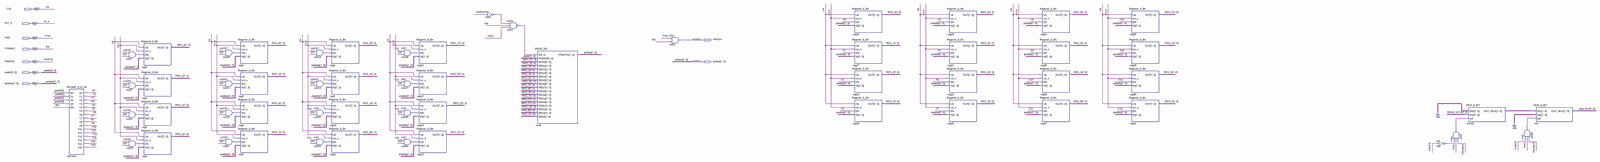
[diagram p0: schematic sheet, whole]
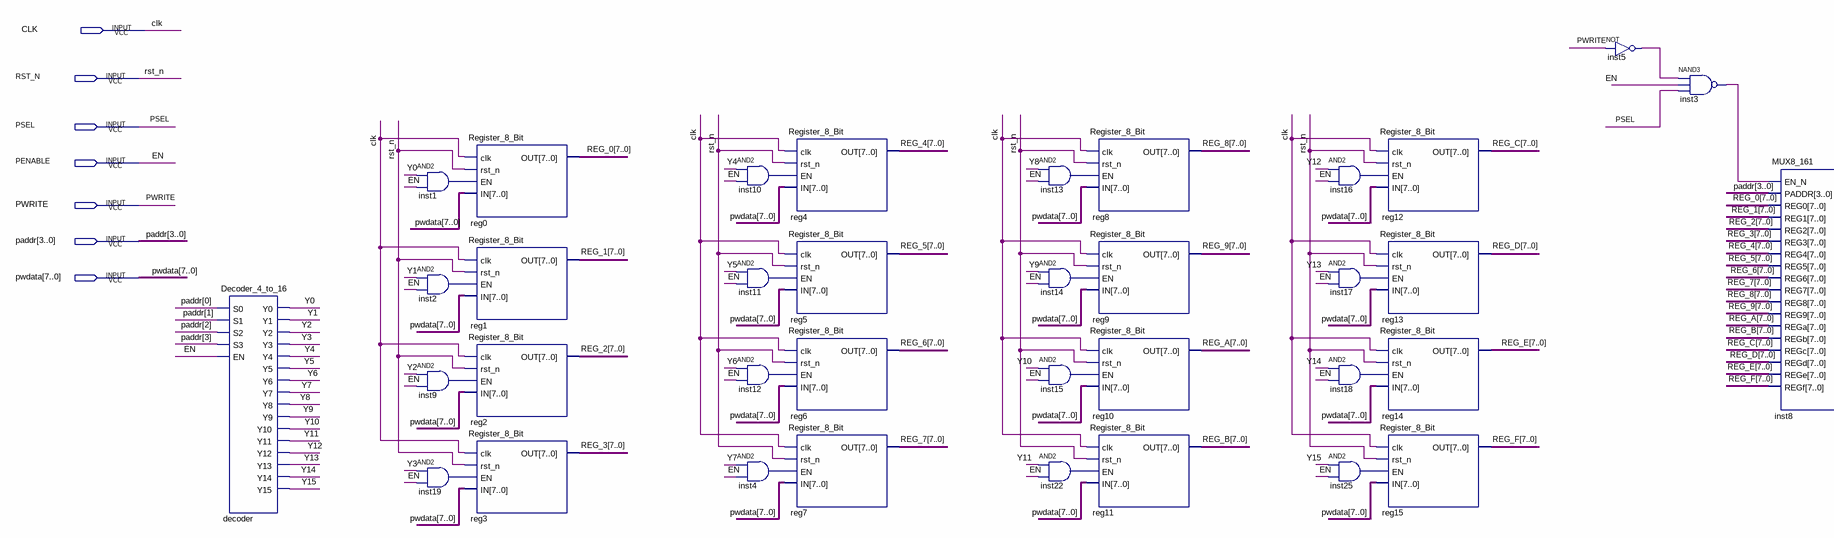
[diagram p1: schematic sheet, left part]
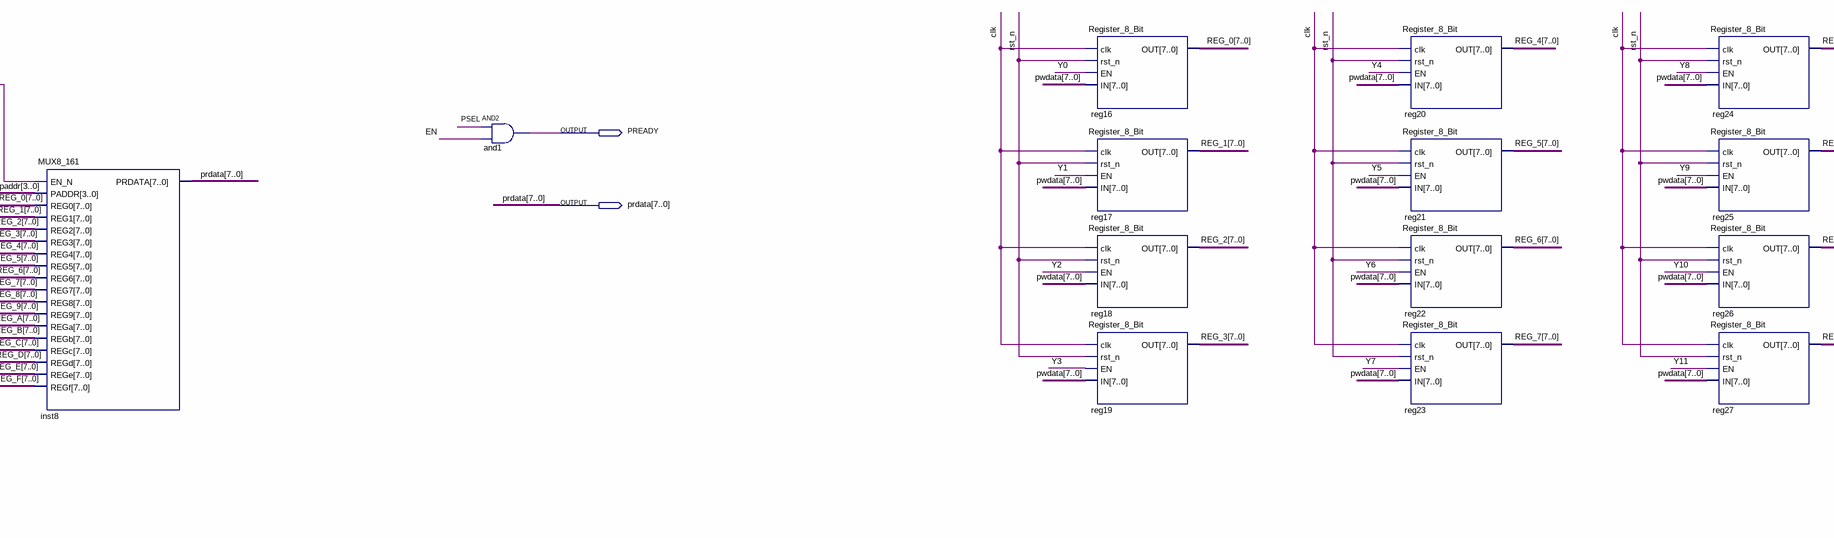
[diagram p2: schematic sheet, centre part]
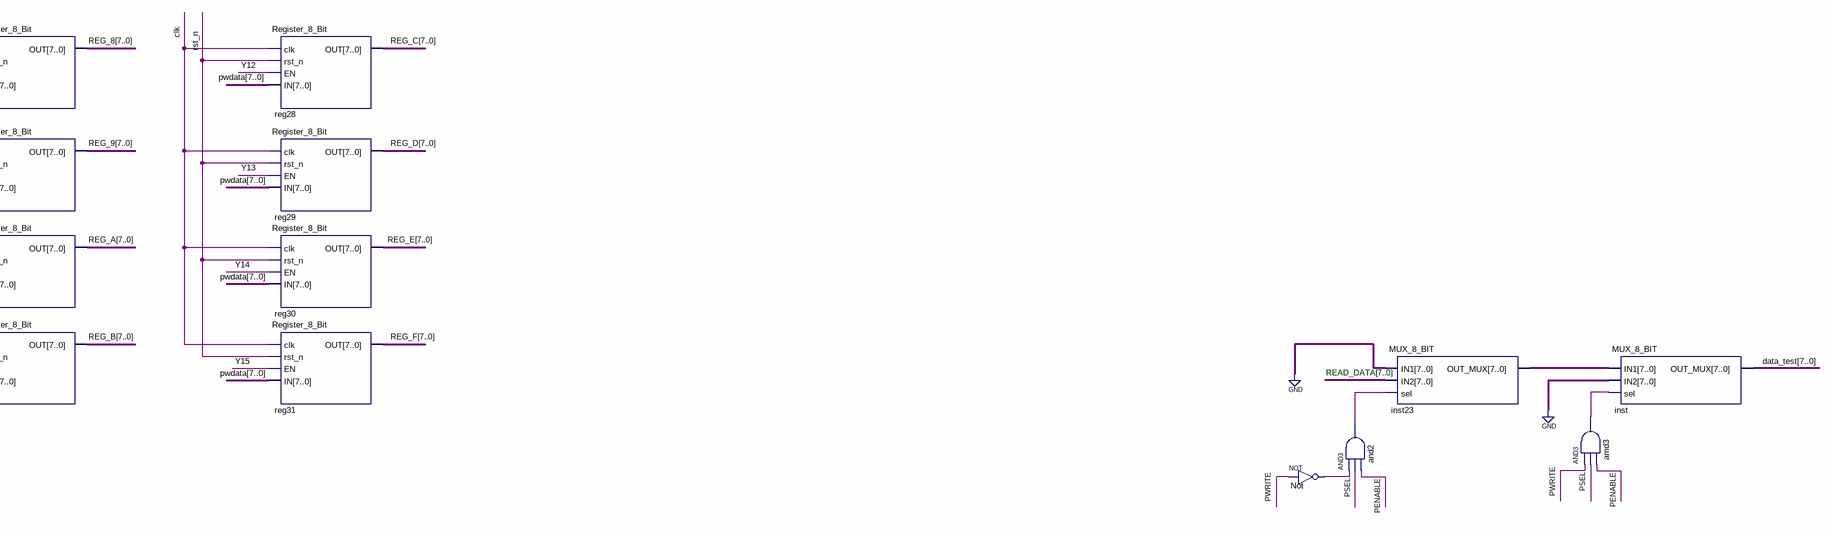
[diagram p3: schematic sheet, right part]
// Quartus schematic temp.bdf as structural Verilog: 58 symbols, 9 pins
module temp (
  input  CLK,
  input  RST_N,
  input  PSEL,
  input  PENABLE,
  input  PWRITE,
  input  [3:0] paddr,
  input  [7:0] pwdata,
  output PREADY,
  output [7:0] prdata
);

  wire amd3_out, and2_out, inst1_out, inst2_out, inst3_out, inst4_out, inst5_out, inst9_out, inst10_out,
       inst11_out, inst12_out, inst13_out, inst14_out, inst15_out, inst16_out, inst17_out, inst18_out,
       inst19_out, inst22_out, inst25_out, Not_out, Y0, Y1, Y2, Y3, Y4, Y5, Y6, Y7, Y8, Y9, Y10, Y11, Y12,
       Y13, Y14, Y15;
  wire [7:0] data_test, inst23_out_mux, READ_DATA, REG_0, REG_1, REG_2, REG_3, REG_4, REG_5, REG_6, REG_7,
       REG_8, REG_9, REG_A, REG_B, REG_C, REG_D, REG_E, REG_F;

  Decoder_4_to_16 decoder (
    .S0(paddr[0]), .S1(paddr[1]), .S2(paddr[2]), .S3(paddr[3]), .EN(PENABLE), .Y0(Y0), .Y1(Y1), .Y2(Y2),
    .Y3(Y3), .Y4(Y4), .Y5(Y5), .Y6(Y6), .Y7(Y7), .Y8(Y8), .Y9(Y9), .Y10(Y10), .Y11(Y11), .Y12(Y12),
    .Y13(Y13), .Y14(Y14), .Y15(Y15));
  and inst1 (inst1_out, Y0, PENABLE);
  and inst2 (inst2_out, Y1, PENABLE);
  and inst9 (inst9_out, Y2, PENABLE);
  and inst19 (inst19_out, Y3, PENABLE);
  Register_8_Bit reg0 (.clk(CLK), .rst_n(RST_N), .EN(inst1_out), .IN(pwdata), .OUT(REG_0));
  Register_8_Bit reg1 (.clk(CLK), .rst_n(RST_N), .EN(inst2_out), .IN(pwdata), .OUT(REG_1));
  Register_8_Bit reg2 (.clk(CLK), .rst_n(RST_N), .EN(inst9_out), .IN(pwdata), .OUT(REG_2));
  Register_8_Bit reg3 (.clk(CLK), .rst_n(RST_N), .EN(inst19_out), .IN(pwdata), .OUT(REG_3));
  and inst10 (inst10_out, Y4, PENABLE);
  and inst11 (inst11_out, Y5, PENABLE);
  and inst12 (inst12_out, Y6, PENABLE);
  and inst4 (inst4_out, Y7, PENABLE);
  Register_8_Bit reg4 (.clk(CLK), .rst_n(RST_N), .EN(inst10_out), .IN(pwdata), .OUT(REG_4));
  Register_8_Bit reg5 (.clk(CLK), .rst_n(RST_N), .EN(inst11_out), .IN(pwdata), .OUT(REG_5));
  Register_8_Bit reg6 (.clk(CLK), .rst_n(RST_N), .EN(inst12_out), .IN(pwdata), .OUT(REG_6));
  Register_8_Bit reg7 (.clk(CLK), .rst_n(RST_N), .EN(inst4_out), .IN(pwdata), .OUT(REG_7));
  and inst13 (inst13_out, Y8, PENABLE);
  and inst14 (inst14_out, Y9, PENABLE);
  and inst15 (inst15_out, Y10, PENABLE);
  and inst22 (inst22_out, Y11, PENABLE);
  Register_8_Bit reg8 (.clk(CLK), .rst_n(RST_N), .EN(inst13_out), .IN(pwdata), .OUT(REG_8));
  Register_8_Bit reg9 (.clk(CLK), .rst_n(RST_N), .EN(inst14_out), .IN(pwdata), .OUT(REG_9));
  Register_8_Bit reg10 (.clk(CLK), .rst_n(RST_N), .EN(inst15_out), .IN(pwdata), .OUT(REG_A));
  Register_8_Bit reg11 (.clk(CLK), .rst_n(RST_N), .EN(inst22_out), .IN(pwdata), .OUT(REG_B));
  and inst16 (inst16_out, Y12, PENABLE);
  and inst17 (inst17_out, Y13, PENABLE);
  and inst18 (inst18_out, Y14, PENABLE);
  and inst25 (inst25_out, Y15, PENABLE);
  Register_8_Bit reg12 (.clk(CLK), .rst_n(RST_N), .EN(inst16_out), .IN(pwdata), .OUT(REG_C));
  Register_8_Bit reg13 (.clk(CLK), .rst_n(RST_N), .EN(inst17_out), .IN(pwdata), .OUT(REG_D));
  Register_8_Bit reg14 (.clk(CLK), .rst_n(RST_N), .EN(inst18_out), .IN(pwdata), .OUT(REG_E));
  Register_8_Bit reg15 (.clk(CLK), .rst_n(RST_N), .EN(inst25_out), .IN(pwdata), .OUT(REG_F));
  not inst5 (inst5_out, PWRITE);
  nand inst3 (inst3_out, inst5_out, PENABLE, PSEL);
  MUX8_161 inst8 (
    .EN_N(inst3_out), .PADDR(paddr), .REG0(REG_0), .REG1(REG_1), .REG2(REG_2), .REG3(REG_3), .REG4(REG_4),
    .REG5(REG_5), .REG6(REG_6), .REG7(REG_7), .REG8(REG_8), .REG9(REG_9), .REGa(REG_A), .REGb(REG_B),
    .REGc(REG_C), .REGd(REG_D), .REGe(REG_E), .REGf(REG_F), .PRDATA(prdata));
  and and1 (PREADY, PSEL, PENABLE);
  Register_8_Bit reg16 (.clk(CLK), .rst_n(RST_N), .EN(Y0), .IN(pwdata), .OUT(REG_0));
  Register_8_Bit reg17 (.clk(CLK), .rst_n(RST_N), .EN(Y1), .IN(pwdata), .OUT(REG_1));
  Register_8_Bit reg18 (.clk(CLK), .rst_n(RST_N), .EN(Y2), .IN(pwdata), .OUT(REG_2));
  Register_8_Bit reg19 (.clk(CLK), .rst_n(RST_N), .EN(Y3), .IN(pwdata), .OUT(REG_3));
  Register_8_Bit reg20 (.clk(CLK), .rst_n(RST_N), .EN(Y4), .IN(pwdata), .OUT(REG_4));
  Register_8_Bit reg21 (.clk(CLK), .rst_n(RST_N), .EN(Y5), .IN(pwdata), .OUT(REG_5));
  Register_8_Bit reg22 (.clk(CLK), .rst_n(RST_N), .EN(Y6), .IN(pwdata), .OUT(REG_6));
  Register_8_Bit reg23 (.clk(CLK), .rst_n(RST_N), .EN(Y7), .IN(pwdata), .OUT(REG_7));
  Register_8_Bit reg24 (.clk(CLK), .rst_n(RST_N), .EN(Y8), .IN(pwdata), .OUT(REG_8));
  Register_8_Bit reg25 (.clk(CLK), .rst_n(RST_N), .EN(Y9), .IN(pwdata), .OUT(REG_9));
  Register_8_Bit reg26 (.clk(CLK), .rst_n(RST_N), .EN(Y10), .IN(pwdata), .OUT(REG_A));
  Register_8_Bit reg27 (.clk(CLK), .rst_n(RST_N), .EN(Y11), .IN(pwdata), .OUT(REG_B));
  Register_8_Bit reg28 (.clk(CLK), .rst_n(RST_N), .EN(Y12), .IN(pwdata), .OUT(REG_C));
  Register_8_Bit reg29 (.clk(CLK), .rst_n(RST_N), .EN(Y13), .IN(pwdata), .OUT(REG_D));
  Register_8_Bit reg30 (.clk(CLK), .rst_n(RST_N), .EN(Y14), .IN(pwdata), .OUT(REG_E));
  Register_8_Bit reg31 (.clk(CLK), .rst_n(RST_N), .EN(Y15), .IN(pwdata), .OUT(REG_F));
  not Not (Not_out, PWRITE);
  and and2 (and2_out, Not_out, PSEL, PENABLE);
  MUX_8_BIT inst23 (.IN1({8{1'b0}}), .IN2(READ_DATA), .sel(and2_out), .OUT_MUX(inst23_out_mux));
  and amd3 (amd3_out, PWRITE, PSEL, PENABLE);
  MUX_8_BIT inst (.IN1(inst23_out_mux), .IN2({8{1'b0}}), .sel(amd3_out), .OUT_MUX(data_test));

  // Other names for the same wires on the sheet: EN = PENABLE

  // Notes on the sheet:
  //   READ_DATA[7..0]
endmodule
